# Altium schematic sheet 4-PPS.SchDoc
size A4
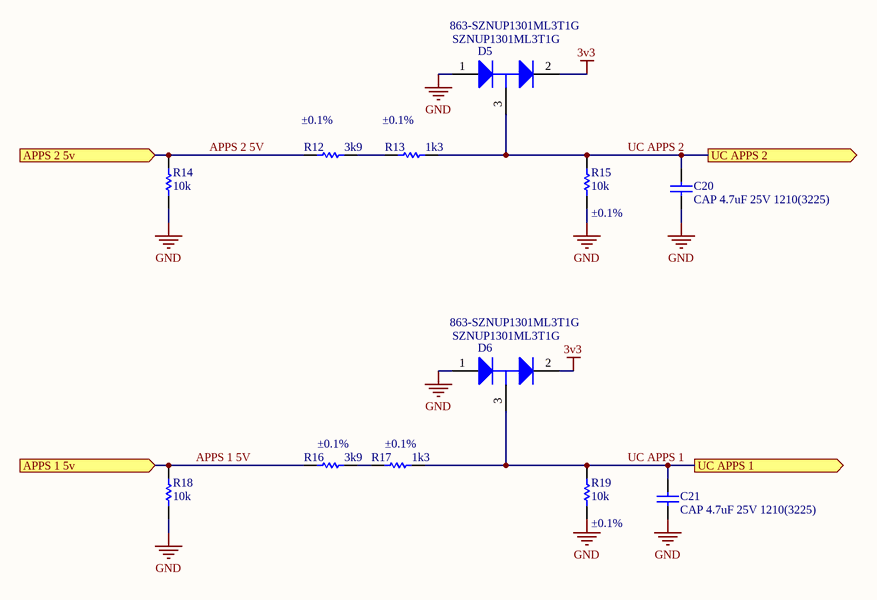
[diagram p0: 4-PPS.SchDoc]

## Parts
C20  CAP 4.7uF 25V 1210(3225)  [CAPC1210(3225)220_M]
C21  CAP 4.7uF 25V 1210(3225)  [CAPC1210(3225)220_M]
D5  SZNUP1301ML3T1G  Supplier Part Number 1: 863-SZNUP1301ML3T1G  [ONSC-SOT-23-3-318-08_V]
D6  SZNUP1301ML3T1G  Supplier Part Number 1: 863-SZNUP1301ML3T1G  [ONSC-SOT-23-3-318-08_V]
R12  value 3k9  Tolerance: ±0.1%  [1608[0603]]  (hidden comment: Res1)
R13  value 1k3  Tolerance: ±0.1%  [1608[0603]]  (hidden comment: Res1)
R14  value 10k  [1608[0603]]  (hidden comment: Res1)
R15  value 10k  Tolerance: ±0.1%  [1608[0603]]  (hidden comment: Res1)
R16  value 3k9  Tolerance: ±0.1%  [1608[0603]]  (hidden comment: Res1)
R17  value 1k3  Tolerance: ±0.1%  [1608[0603]]  (hidden comment: Res1)
R18  value 10k  [1608[0603]]  (hidden comment: Res1)
R19  value 10k  Tolerance: ±0.1%  [1608[0603]]  (hidden comment: Res1)

## Ports
APPS 1 5v (in), APPS 2 5v (in), UC APPS 1 (out), UC APPS 2 (out)

## Nets
3v3: D5.2(K) D6.2(K)
GND: C20.1 C21.1 D5.1(A) D6.1(A) R14.1 R15.1 R18.1 R19.1
APPS 1 5V: R16.1 R18.2 ; port APPS 1 5v
APPS 2 5V: R12.1 R14.2 ; port APPS 2 5v
UC APPS 1: C21.2 D6.3(K/A) R17.2 R19.2 ; port UC APPS 1
UC APPS 2: C20.2 D5.3(K/A) R13.2 R15.2 ; port UC APPS 2
NetR12_2: R12.2 R13.1
NetR16_2: R16.2 R17.1

## Library data of the parts
C20 C21 = CMP-1038-02151-2: CAP 4.7uF 25V ±10% 1210 (3225 Metric) Thickness 2.2mm SMD; Case-Metric: 3225; Case-EIA: 1210; Tolerance: Â±10%; Value: 4.7uF; Technology: SMT; Max Thickness: 2.2 mm; Rated Voltage: 25 V
D5 D6 = CMP-1063-00171-1: Low Capacitance Diode Array for ESD Protection in a Single Data Line, 3-Pin SOT-23, Pb-Free, Tape and Reel; Manufacturer: On Semiconductor; C Max (pF): 0.9; Direction: Bidirectional; V(BR) Min (V): 70; Number of Lines: 1; Mounting Technology: Surface Mount; PackageReference: SOT-23-3-318-08; DatasheetVersion: Rev. 6; PackageVersion: Rev. AP, 11/2009; RoHS: Pb-Free; ComponentLink1Description: Manufacturer URL; ComponentLink1URL: http://www.onsemi.com/; PackageDescription: 3-Pin Small Outline Transistor, Body 2.92 x 1.3 mm, Pitch 0.95 mm; PartNumber: SZNUP1301ML3T1G; Packing: Tape and Reel; ComponentLink3URL: http://www.onsemi.cn/pub_link/Collateral/318-08.PDF; ComponentLink3Description: Package Specification; VRWM Max (V): 70; ComponentLink2Description: Datasheet; ComponentLink2URL: http://www.onsemi.cn/pub_link/Collateral/NUP1301ML3T1-D.PDF; Supplier 1: Mouser
R12 R16 = Res1: Resistor; Manufacturer: Yageo; Manufacturer Part Number: RT0603BRD073K9L; Resistance (Ohms): 3.9k; Power (Watts): 0.1W, 1/10W; Temperature Coefficient: ±25ppm/°C; Supplier 1: Digi-Key; Supplier Part Number 1: YAG1656CT-ND; RoHS: RoHS Compliant; Category: Resistors; Stock 1: 10688; Pricing 1: 1=0.55, 10=0.464, 25=0.3376, 50=0.2446, 100=0.1814, 250=0.1392, 500=0.10966, 1000=0.07592 (CAD); Packaging: Cut Tape (CT); Part Status: Active; Composition: Thin Film; Features: Moisture Resistant; Operating Temperature: -55°C ~ 155°C; Package / Case: 0603 (1608 Metric); Supplier Device Package: 0603; Size / Dimension: 0.063" L x 0.031" W (1.60mm x 0.80mm); Height - Seated (Max): 0.022" (0.55mm); Number of Terminations: 2; Failure Rate: -; ComponentLink1URL: http://www.yageo.com/documents/recent/PYu-RT_1-to-0.05_RoHS_L_6.pdf; ComponentLink1Description: http://www.yageo.com/documents/recent/PYu-RT_1-to-0.05_RoHS_L_6.pdf
R13 R17 = Res1: Resistor; Manufacturer: Yageo; Manufacturer Part Number: RT0603BRD071K3L; Resistance (Ohms): 1.3k; Power (Watts): 0.1W, 1/10W; Temperature Coefficient: ±25ppm/°C; Supplier 1: Digi-Key; Supplier Part Number 1: YAG1565CT-ND; RoHS: RoHS Compliant; Category: Resistors; Stock 1: 2236; Pricing 1: 1=0.55, 10=0.464, 25=0.3376, 50=0.2446, 100=0.1814, 250=0.1392, 500=0.10966, 1000=0.07592 (CAD); Packaging: Cut Tape (CT); Part Status: Active; Composition: Thin Film; Features: Moisture Resistant; Operating Temperature: -55°C ~ 155°C; Package / Case: 0603 (1608 Metric); Supplier Device Package: 0603; Size / Dimension: 0.063" L x 0.031" W (1.60mm x 0.80mm); Height - Seated (Max): 0.022" (0.55mm); Number of Terminations: 2; Failure Rate: -; ComponentLink1URL: http://www.yageo.com/documents/recent/PYu-RT_1-to-0.05_RoHS_L_6.pdf; ComponentLink1Description: http://www.yageo.com/documents/recent/PYu-RT_1-to-0.05_RoHS_L_6.pdf
R14 R18 = Res1: Resistor; Manufacturer: Yageo; Manufacturer Part Number: RC0603JR-0710KL; Tolerance: ±5%; Power (Watts): 0.1W, 1/10W; Temperature Coefficient: ±100ppm/°C; Supplier 1: Digi-Key; Supplier Part Number 1: 311-10KGRCT-ND; RoHS: RoHS Compliant; Category: Resistors; Stock 1: 2936292; Pricing 1: 1=0.16, 10=0.016, 25=0.0112, 50=0.0084, 100=0.0062, 250=0.0048, 500=0.00382, 1000=0.00281 (CAD); Packaging: Cut Tape (CT); Part Status: Active; Resistance (Ohms): 10k; Composition: Thick Film; Features: Moisture Resistant; Operating Temperature: -55°C ~ 155°C; Package / Case: 0603 (1608 Metric); Supplier Device Package: 0603; Size / Dimension: 0.063" L x 0.031" W (1.60mm x 0.80mm); Height - Seated (Max): 0.022" (0.55mm); Number of Terminations: 2; Failure Rate: -; ComponentLink1URL: http://www.yageo.com/NewPortal/yageodocoutput?fileName=/pdf/R-Chip/PYu-RC_Group_51_RoHS_L_4.pdf; ComponentLink1Description: http://www.yageo.com/NewPortal/yageodocoutput?fileName=/pdf/R-Chip/PYu-RC_Group_51_RoHS_L_4.pdf
R15 R19 = Res1: Resistor; Manufacturer: Yageo; Manufacturer Part Number: RT0603BRD0710KL; Power (Watts): 0.1W, 1/10W; Temperature Coefficient: ±25ppm/°C; Supplier 1: Digi-Key; Supplier Part Number 1: YAG1236CT-ND; RoHS: RoHS Compliant; Category: Resistors; Stock 1: 2958; Pricing 1: 1=0.5, 10=0.42, 25=0.3048, 50=0.2212, 100=0.164, 250=0.12592, 500=0.0992, 1000=0.06867 (CAD); Packaging: Cut Tape (CT); Part Status: Active; Resistance (Ohms): 10k; Composition: Thin Film; Features: Moisture Resistant; Operating Temperature: -55°C ~ 155°C; Package / Case: 0603 (1608 Metric); Supplier Device Package: 0603; Size / Dimension: 0.063" L x 0.031" W (1.60mm x 0.80mm); Height - Seated (Max): 0.022" (0.55mm); Number of Terminations: 2; Failure Rate: -; ComponentLink1URL: http://www.yageo.com/documents/recent/PYu-RT_1-to-0.05_RoHS_L_6.pdf; ComponentLink1Description: http://www.yageo.com/documents/recent/PYu-RT_1-to-0.05_RoHS_L_6.pdf